# Altium schematic sheet Sensor Board.SchDoc
size A3; ApprovedBy: Betül Demirhan; CheckedBy: UDEMY; DrawnBy: Furkan Demirhan; Revision: AA; SheetNumber: 5; SheetTotal: 5; ProjectDescription: Sensor Board of Wireless Security Detector
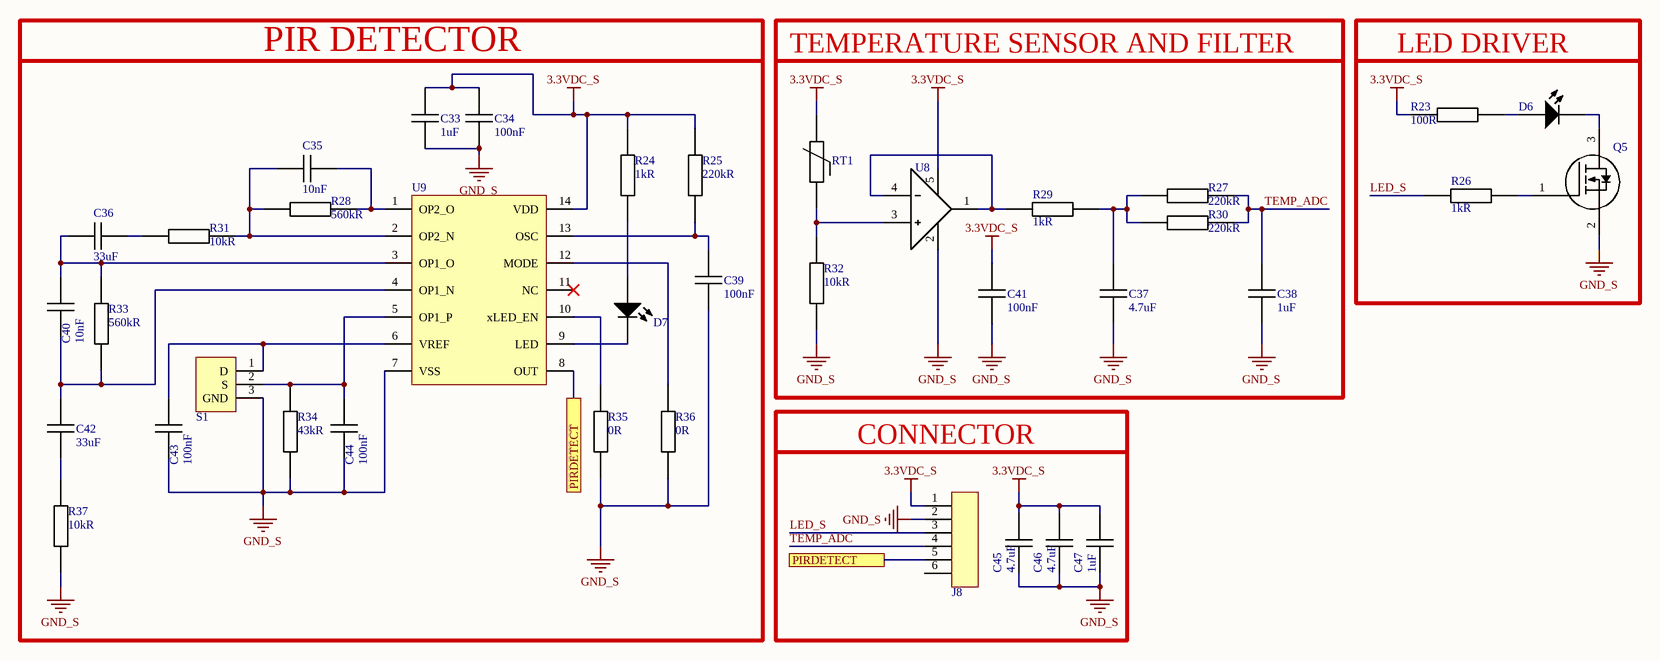
[diagram p0: Sensor Board.SchDoc]

## Parts
C33  value 1uF  [CAP_0805]  (hidden comment: CL21B105KBFNNNE)
C34  value 100nF  [CAP_0805]  (hidden comment: CL21B104KBCNNNC)
C35  value 10nF  [CAP_0603]  (hidden comment: 0603B103K160CT)
C36  value 33uF  [CAP_1206]  (hidden comment: C3216X5R1E336M160AC)
C37  value 4.7uF  [CAP_0805]  (hidden comment: CL21A475KAQNNNE)
C38  value 1uF  [CAP_0805]  (hidden comment: CL21B105KBFNNNE)
C39  value 100nF  [CAP_0603]  (hidden comment: C0603C104M5RACTU)
C40  value 10nF  [CAP_0603]  (hidden comment: 0603B103K160CT)
C41  value 100nF  [CAP_0603]  (hidden comment: C0603C104M5RACTU)
C42  value 33uF  [CAP_1206]  (hidden comment: C3216X5R1E336M160AC)
C43  value 100nF  [CAP_0603]  (hidden comment: C0603C104M5RACTU)
C44  value 100nF  [CAP_0603]  (hidden comment: C0603C104M5RACTU)
C45  value 4.7uF  [CAP_0805]  (hidden comment: CL21A475KAQNNNE)
C46  value 4.7uF  [CAP_0805]  (hidden comment: CL21A475KAQNNNE)
C47  value 1uF  [CAP_0805]  (hidden comment: CL21B105KBFNNNE)
D6  LTST-C171KRKT  [LED_RED_0805]  (value not drawn)
D7  LTST-C171GKT  [LED_GREEN_0805]  (value not drawn)
J8  64800611622  [64800611622]  (value not drawn)
Q5  SSM3K357R,LF  [SOT23F]  (value not drawn)
R23  value 100R  [RES_0603]  (hidden comment: RC0603FR-07100RL)
R24  value 1kR  [RES_0603]  (hidden comment: RC0603FR-071KL)
R25  value 220kR  [RES_0603]  (hidden comment: RC0603JR-07220KL)
R26  value 1kR  [RES_0603]  (hidden comment: RC0603FR-071KL)
R27  value 220kR  [RES_0603]  (hidden comment: RC0603JR-07220KL)
R28  value 560kR  [RES_0603]  (hidden comment: RC0603JR-07560KL)
R29  value 1kR  [RES_0603]  (hidden comment: RC0603FR-071KL)
R30  value 220kR  [RES_0603]  (hidden comment: RC0603JR-07220KL)
R31  value 10kR  [RES_0603]  (hidden comment: RC0603FR-0710KL)
R32  value 10kR  [RES_0603]  (hidden comment: RC0603FR-0710KL)
R33  value 560kR  [RES_0603]  (hidden comment: RC0603JR-07560KL)
R34  value 43kR  [RES_0603]  (hidden comment: RC0603JR-0743KL)
R35  value 0R  [RES_0603]  (hidden comment: RC0603JR-070RL)
R36  value 0R  [RES_0603]  (hidden comment: RC0603JR-070RL)
R37  value 10kR  [RES_0603]  (hidden comment: RC0603FR-0710KL)
RT1  TFPT1206L1002FM  [RT_1206]  (value not drawn)
S1  LHI 878/3902  [LHI 878]  (value not drawn)
U8  OPA314AIDBVR  [SOT23-5]  (value not drawn)
U9  NCS36000DRG  [SOIC14]  (value not drawn)

## Ports
PIRDETECT (see Sensor Board[3B]), PIRDETECT (see Sensor Board[4B])

## Nets
3.3VDC_S: C33.2 C34.1 C41.1 C45.2 C46.2 C47.2 J8.1 R23.1 R24.1 R25.1 RT1.1 U8.5(V+) U9.14(VDD)
GND_S: C33.1 C34.2 C37.1 C38.2 C39.2 C41.2 C43.2 C44.2 C45.1 C46.1 C47.1 J8.2 Q5.2(S) R32.1 R34.2 R35.2 R36.2 R37.1 S1.3(GND) U8.2(V-) U9.7(VSS)
LED_S: J8.3 R26.1
PIRDETECT: J8.5 U9.8(OUT) ; port PIRDETECT
TEMP_ADC: C38.1 J8.4 R27.2 R30.2
NetC35_1: C35.1 R28.2 U9.1(OP2_O)
NetC35_2: C35.2 R28.1 R31.2 U9.2(OP2_N)
NetC36_1: C36.1 R31.1
NetC36_2: C36.2 C40.2 R33.1 U9.3(OP1_O)
NetC37_2: C37.2 R27.1 R29.2 R30.1
NetC39_1: C39.1 R25.2 U9.13(OSC)
NetC40_1: C40.1 C42.1 R33.2 U9.4(OP1_N)
NetC42_2: C42.2 R37.2
NetC43_1: C43.1 S1.1(D) U9.6(VREF)
NetC44_1: C44.1 R34.1 S1.2(S) U9.5(OP1_P)
NetD6_1: D6.1 R23.2
NetD6_2: D6.2 Q5.3(D)
NetD7_1: D7.1 R24.2
NetD7_2: D7.2 U9.9(LED)
NetQ5_1: Q5.1(G) R26.2
NetR29_1: R29.1 U8.1(OUT) U8.4(IN-)
NetR32_2: R32.2 RT1.2 U8.3(IN+)
NetR35_1: R35.1 U9.10(xLED_EN)
NetR36_1: R36.1 U9.12(MODE)

Not connected (* = marked no-connect by the designer): J8 6; U9 11(NC)*

## Notes on the sheet
- PIR DETECTOR
- TEMPERATURE SENSOR AND FILTER
- LED DRIVER
- CONNECTOR
- DOCUMENT NAME
- DESCRIPTION
- DRAWN BY
- RELEASE DATE
- CHECKED BY
- CHANGE DATE
- APPROVED BY
- DEPARTMENT
- R&D Hardware
- SIZE
- A3
- REVISION
- SHEET
- /

## Library data of the parts
C33 C38 C47 = CAP CER 1uF 0805: Multilayer Ceramic Capacitor, 1 uF, 50 V, 10%, X7R, 0805 [2012 Metric]; Manufacturer: Samsung; Voltage Rating: 50V; Designed by: FURKAN; Supplier: Digikey; Supplier Part Number: 1276-1029-1-ND; Manufacturer Part Number: CL21B105KBFNNNE; RoHS: Yes; Category: Ceramic Capacitors; Stock: 845645; Pricing: 1=0,11, 10=0,061, 50=0,042, 100=0,0361, 500=0,02632, 1000=0,02327, 2000=0,02075, 4000=0,01867, 6000=0,01762, 10000=0,01646, 14000=0,01578, 20000=0,01512, 50000=0,0137, 100000=0,01283, 200000=0,01212 (USD); Mounting Technology: Surface Mount; Case/Package: 0805; Case Code (Metric): 2012; Case Code (Imperial): 0805; Material: Ceramic; Min Operating Temperature: -55°C; Max Operating Temperature: 125°C; Tolerance: 10%; Packaging: Tape and Reel; Package Quantity: 1; Dielectric: X7R; Voltage: 50V; Series: CL; Construction: Flat; Voltage Rating (DC): 50V; Length: 2mm; Width: 0.049inch; Height: 1.25mm; Thickness: 0.053inch; Depth: 1.25mm; Radiation Hardening: No; RoHS Compliant: Yes; ComponentLink1URL: https://datasheet.ciiva.com/25800/cl21b105kbfnnne-25800291.pdf?src-supplier=Digikey; ComponentLink1Description: https://datasheet.ciiva.com/25800/cl21b105kbfnnne-25800291.pdf?src-supplier=Digikey; ComponentLink2URL: https://datasheet.ciiva.com/16449/cl21b105kbfnnne-16449003.pdf?src-supplier=Future+Electronics; ComponentLink2Description: https://datasheet.ciiva.com/16449/cl21b105kbfnnne-16449003.pdf?src-supplier=Future+Electronics; ComponentLink3URL: https://datasheet.ciiva.com/26838/getdatasheetpartid-354075-26838668.pdf?src-supplier=Verical; ComponentLink3Description: https://datasheet.ciiva.com/26838/getdatasheetpartid-354075-26838668.pdf?src-supplier=Verical
C34 = CAP CER 100nF 0805: CAP CER 100 nF 10% 50 V 0805 SMD; Manufacturer: Samsung; Designed by: FURKAN; Material: Ceramic; Dielectric: X7R; Voltage Rating: 50V; Supplier: Digikey; Supplier Part Number: 1276-1003-1-ND; Manufacturer Part Number: CL21B104KBCNNNC; RoHS: Yes; Category: Ceramic Capacitors; Stock: 2055733; Pricing: 1=0,1, 10=0,035, 50=0,0238, 100=0,0203, 500=0,01446, 1000=0,01266, 4000=0,00995, 8000=0,00893, 12000=0,00842, 20000=0,00785, 28000=0,00752, 40000=0,0072, 100000=0,00651, 200000=0,00609, 400000=0,00574 (USD); Mounting Technology: Surface Mount; Case/Package: 0805; Case Code (Metric): 2012; Case Code (Imperial): 0805; Min Operating Temperature: -55°C; Max Operating Temperature: 125°C; Tolerance: 10%; Packaging: Tape and Reel; Voltage: 50V; Series: CL; Construction: Flat; Voltage Rating (DC): 50V; Length: 2mm; Width: 0.049inch; Height: 0.85mm; Depth: 1.25mm; Thickness: 0.037inch; Radiation Hardening: No; RoHS Compliant: Yes; Lead Free: 5697LeadFree; ComponentLink1URL: https://datasheet.ciiva.com/25710/cl21b104kbcnnnc-25710182.pdf?src-supplier=Digikey; ComponentLink1Description: https://datasheet.ciiva.com/25710/cl21b104kbcnnnc-25710182.pdf?src-supplier=Digikey; ComponentLink2URL: https://datasheet.ciiva.com/29199/454152-da-01-en-vs-kondensator-0805-29199814.pdf?src-supplier=Conrad; ComponentLink2Description: https://datasheet.ciiva.com/29199/454152-da-01-en-vs-kondensator-0805-29199814.pdf?src-supplier=Conrad
C35 C40 = CAP CER 10nF 0603: CAP CER 10nF 10% 16V 0603 SMD; Manufacturer: Walsin Technologies; Designed by: FURKAN; Supplier: Digikey; Supplier Part Number: 1292-1384-1-ND; Manufacturer Part Number: 0603B103K160CT; RoHS: Yes; Category: Ceramic Capacitors; Stock: 59480; Pricing: 1=0,1, 10=0,031, 50=0,018, 100=0,0139, 500=0,0105, 1000=0,00825 (USD); Lead Free: 5697LeadFree; ComponentLink1URL: http://www.farnell.com/datasheets/1958513.pdf?src-supplier=Farnell; ComponentLink1Description: http://www.farnell.com/datasheets/1958513.pdf?src-supplier=Farnell; ComponentLink2URL: https://datasheet.octopart.com/0603B103K160CT-Walsin-Technologies-datasheet-136037192.pdf?src-supplier=Future+Electronics; ComponentLink2Description: https://datasheet.octopart.com/0603B103K160CT-Walsin-Technologies-datasheet-136037192.pdf?src-supplier=Future+Electronics; ComponentLink3URL: http://www.passivecomponent.com/wp-content/uploads/2018/10/MLCC.pdf?src-supplier=Digikey; ComponentLink3Description: http://www.passivecomponent.com/wp-content/uploads/2018/10/MLCC.pdf?src-supplier=Digikey; ComponentLink4URL: https://datasheet.octopart.com/0603B103K160CT-Walsin-Technologies-datasheet-85392065.pdf?src-supplier=Element14; ComponentLink4Description: https://datasheet.octopart.com/0603B103K160CT-Walsin-Technologies-datasheet-85392065.pdf?src-supplier=Element14; ComponentLink5URL: https://datasheet.octopart.com/0603B103K160CT-Walsin-Technologies-datasheet-62066062.pdf?src-supplier=TME; ComponentLink5Description: https://datasheet.octopart.com/0603B103K160CT-Walsin-Technologies-datasheet-62066062.pdf?src-supplier=TME; Case/Package: 0603
C36 C42 = CAP CER 33uF 1206: CAP CER 33 uF ± 20% 25 V 1206 SMD; Manufacturer: TDK; Designed by: FURKAN; Material: 4241ConductorMaterial; Supplier: Digikey; Supplier Part Number: 445-8046-1-ND; Manufacturer Part Number: C3216X5R1E336M160AC; RoHS: Yes; Category: Ceramic Capacitors; Stock: 176112; Pricing: 1=1,3, 10=0,813, 50=0,6166, 100=0,5552, 500=0,45066, 1000=0,41798 (USD); ComponentLink1URL: https://datasheet.ciiva.com/24216/c3216x5r1e336m160ac-265051-24216512.pdf?src-supplier=Mouser; ComponentLink1Description: https://datasheet.ciiva.com/24216/c3216x5r1e336m160ac-265051-24216512.pdf?src-supplier=Mouser; ComponentLink2URL: https://datasheet.ciiva.com/6285/tdkmlcccaprange-6285278.pdf?src-supplier=Digikey; ComponentLink2Description: https://datasheet.ciiva.com/6285/tdkmlcccaprange-6285278.pdf?src-supplier=Digikey; Case/Package: 1206
C37 C45 C46 = CAP CER 4.7uF 0805: Multilayer Ceramic Capacitor, 4.7 uF, 25 V, ± 10%, X5R, 0805 [2012 Metric]; Manufacturer: Samsung; Designed by: FURKAN; Voltage Rating: 25V; ComponentLink1URL: https://datasheet.ciiva.com/25798/cl21a475kaqnnne-25798882.pdf?src-supplier=Digikey; ComponentLink1Description: https://datasheet.ciiva.com/25798/cl21a475kaqnnne-25798882.pdf?src-supplier=Digikey; Supplier: Digikey; Supplier Part Number: 1276-1244-1-ND; Manufacturer Part Number: CL21A475KAQNNNE; RoHS: Yes; Category: Ceramic Capacitors; Stock: 2972760; Pricing: 1=0,1, 10=0,057, 50=0,0394, 100=0,0339, 500=0,02466, 1000=0,02177 (USD); Mounting Technology: Surface Mount; Case/Package: 0805; Case Code (Metric): 2012; Case Code (Imperial): 0805; Material: Ceramic; Min Operating Temperature: -55°C; Max Operating Temperature: 85°C; Packaging: Tape and Reel; Tolerance: 10%; Dielectric: X5R; Voltage Rating (DC): 25V; Series: CL; Construction: Flat; Length: 2mm; Height: 1.25mm; Depth: 1.25mm; Radiation Hardening: No; Lead Free: Lead Free; RoHS Compliant: Yes
C39 C41 C43 C44 = CAP CER 100nF 0603: CAP CER 100 nF %20 0603 SMD; Manufacturer: KEMET; Designed by: FURKAN; Dielectric Material: 4241ConductorMaterial; Tolerance: 20%; Dielectric: X7R; Voltage Rating: 50V; Dissipation Factor: 2.5%; Temperature Coefficient: 30ppm/°C; Supplier: Digikey; Supplier Part Number: 399-C0603C104M5RACTUCT-ND; Manufacturer Part Number: C0603C104M5RACTU; RoHS: Yes; Category: Ceramic Capacitors; Stock: 2297166; Pricing: 1=0,1, 10=0,027, 50=0,0184, 100=0,0156, 500=0,01104, 1000=0,00962 (USD); Mounting Technology: Surface Mount,PCB; Case/Package: 0603; Pins: 2NUMBER; Case Code (Metric): 1608; Case Code (Imperial): 0603; Material: 4241ConductorMaterial; Min Operating Temperature: -55°C; Max Operating Temperature: 125°C; Package Quantity: 4000; Packaging: Tape and Reel; Voltage Rating (DC): 50V; Termination: SMD/SMT; Series: SMD Comm X7R; Construction: Flat; Length: 1.6mm; Width: 0.031inch; Height: 0.8mm; Thickness: 0.034inch; Lead Pitch: 0.7mm; Depth: 0.8mm; Radiation Hardening: No; Reach SVHC Compliant: No; ComponentLink1URL: http://components.arrow.com/part/dataview/40911037S8853915N7429?src-supplier=Arrow+Electronics; ComponentLink1Description: http://components.arrow.com/part/dataview/40911037S8853915N7429?src-supplier=Arrow+Electronics; ComponentLink2URL: http://www.farnell.com/datasheets/2746056.pdf?src-supplier=Farnell; ComponentLink2Description: http://www.farnell.com/datasheets/2746056.pdf?src-supplier=Farnell; ComponentLink3URL: https://www.verical.com/server-webapp/html/getDatasheet?partID=626892&src-supplier=Verical; ComponentLink3Description: https://www.verical.com/server-webapp/html/getDatasheet?partID=626892&src-supplier=Verical; ComponentLink4URL: http://www.mouser.com/ds/2/212/KEM_C1002_X7R_SMD-1102033.pdf?src-supplier=Mouser; ComponentLink4Description: http://www.mouser.com/ds/2/212/KEM_C1002_X7R_SMD-1102033.pdf?src-supplier=Mouser; ComponentLink5URL: http://www.alliedelec.com/m/d/6f3b5eb83d09db50ed28bdc730567b33.pdf?src-supplier=Allied+Electronics; ComponentLink5Description: http://www.alliedelec.com/m/d/6f3b5eb83d09db50ed28bdc730567b33.pdf?src-supplier=Allied+Electronics; ComponentLink6URL: http://www.farnell.com/datasheets/1828800.pdf?src-supplier=Newark; ComponentLink6Description: http://www.farnell.com/datasheets/1828800.pdf?src-supplier=Newark; ComponentLink7URL: https://datasheet.octopart.com/C0603C104M5RACTU-Kemet-datasheet-5313890.pdf?src-supplier=Verical; ComponentLink7Description: https://datasheet.octopart.com/C0603C104M5RACTU-Kemet-datasheet-5313890.pdf?src-supplier=Verical; ComponentLink8URL: http://capacitoredge.kemet.com/capedge2/DataSheet?pn=C0603C104M5RAC7867&src-supplier=Avnet; ComponentLink8Description: http://capacitoredge.kemet.com/capedge2/DataSheet?pn=C0603C104M5RAC7867&src-supplier=Avnet; ComponentLink9URL: http://www.farnell.com/datasheets/2315113.pdf?src-supplier=Newark; ComponentLink9Description: http://www.farnell.com/datasheets/2315113.pdf?src-supplier=Newark; ComponentLink10URL: https://api.kemet.com/component-edge/download/datasheet/C0603C104M5RACTU.pdf?src-supplier=Digikey; ComponentLink10Description: https://api.kemet.com/component-edge/download/datasheet/C0603C104M5RACTU.pdf?src-supplier=Digikey; ComponentLink11URL: https://datasheet.octopart.com/C0603C104M5RACTU-Kemet-datasheet-65850025.pdf?src-supplier=Element14; ComponentLink11Description: https://datasheet.octopart.com/C0603C104M5RACTU-Kemet-datasheet-65850025.pdf?src-supplier=Element14; ComponentLink12URL: http://www.farnell.com/datasheets/2746056.pdf?src-supplier=Element14; ComponentLink12Description: http://www.farnell.com/datasheets/2746056.pdf?src-supplier=Element14; ComponentLink13URL: http://www.farnell.com/datasheets/2746056.pdf?src-supplier=Newark; ComponentLink13Description: http://www.farnell.com/datasheets/2746056.pdf?src-supplier=Newark; ComponentLink14URL: https://datasheet.octopart.com/C0603C104M5RACTU-KEMET-datasheet-157246124.pdf?src-supplier=Electro+Sonic; ComponentLink14Description: https://datasheet.octopart.com/C0603C104M5RACTU-KEMET-datasheet-157246124.pdf?src-supplier=Electro+Sonic; ComponentLink15URL: https://datasheet.octopart.com/C0603C104M5RACTU-KEMET-datasheet-68331906.pdf?src-supplier=TME; ComponentLink15Description: https://datasheet.octopart.com/C0603C104M5RACTU-KEMET-datasheet-68331906.pdf?src-supplier=TME
D6 = LED RED 0805: LED Uni-Color Red 639nm 2-Pin Chip LED T/R; Manufacturer: Vishay Lite-On; Designed by: FURKAN; Supplier: Digikey; Supplier Part Number: 160-1427-1-ND; Manufacturer Part Number: LTST-C171KRKT; RoHS: Yes; Category: LEDs; Stock: 423441; Pricing: 1=0,23, 10=0,127, 100=0,0762, 500=0,05646, 1000=0,05041 (USD); Wavelength: 639nm; Lead Free: 5697LeadFree; ComponentLink1URL: https://datasheet.ciiva.com/11775/0900766b80dc0299-11775643.pdf?src-supplier=Rs; ComponentLink1Description: https://datasheet.ciiva.com/11775/0900766b80dc0299-11775643.pdf?src-supplier=Rs; ComponentLink2URL: https://datasheet.ciiva.com/12403/lite-on-ltst-c171krkt-187201-12403781.pdf?src-supplier=Mouser; ComponentLink2Description: https://datasheet.ciiva.com/12403/lite-on-ltst-c171krkt-187201-12403781.pdf?src-supplier=Mouser; ComponentLink3URL: https://datasheet.ciiva.com/16444/lite-on20ltst-c171krkt-16444779.pdf?src-supplier=Future+Electronics; ComponentLink3Description: https://datasheet.ciiva.com/16444/lite-on20ltst-c171krkt-16444779.pdf?src-supplier=Future+Electronics; ComponentLink4URL: https://datasheet.ciiva.com/2110/s-110-ltst-c171krkt-2110066.pdf?src-supplier=Digikey; ComponentLink4Description: https://datasheet.ciiva.com/2110/s-110-ltst-c171krkt-2110066.pdf?src-supplier=Digikey; ComponentLink5URL: https://datasheet.ciiva.com/2110/s-110-ltst-c171krkt-2110067.pdf?src-supplier=Digikey; ComponentLink5Description: https://datasheet.ciiva.com/2110/s-110-ltst-c171krkt-2110067.pdf?src-supplier=Digikey; ComponentLink6URL: https://datasheet.ciiva.com/2110/s-110-ltst-c171krkt-2110068.pdf?src-supplier=Digikey; ComponentLink6Description: https://datasheet.ciiva.com/2110/s-110-ltst-c171krkt-2110068.pdf?src-supplier=Digikey; Case/Package: 0805
D7 = LED GREEN 0805: LED Low-Power Uni-Color Green 565nm 2.1V 2-Pin Chip LED T/R; Manufacturer: Vishay Lite-On; Designed by: FURKAN; Lens Color: Colorless; Viewing Angle: 130°; Lens Style: Flat,Diffused,Colorless,Rectangular,Clear; Luminous Intensity: 12mcd; Forward Current: 30mA; Power Rating: 100mW; Dominant Wavelength: 569nm; Test Current: 10mA; Lens Transparency: Clear; Number of Elements: 1; Reverse Voltage: 5V; Lens Size: 1.25mm; Supplier: Digikey; Supplier Part Number: 160-1423-1-ND; Manufacturer Part Number: LTST-C171GKT; RoHS: Yes; Category: LEDs; Stock: 540958; Pricing: 1=0,22, 10=0,121, 100=0,0725, 500=0,0536, 1000=0,04781, 3000=0,04084, 6000=0,03738, 9000=0,03565, 15000=0,03374, 21000=0,03263, 30000=0,03157, 75000=0,02928, 150000=0,0279, 300000=0,02678 (USD); Mounting Technology: Surface Mount; Case/Package: 0805; Pins: 2; Color: Green; Case Code (Metric): 2012; Case Code (Imperial): 0805; Min Operating Temperature: -55°C; Max Operating Temperature: 85°C; Package Quantity: 3000; Packaging: Tape and Reel; Forward Voltage: 2.1V; Illumination Color: Green; Power Dissipation: 100mW; Wavelength: 565nm; Number of LEDs: 1; Series: -; Length: 2mm; Width: 1.25mm; Height: 0.9mm; Depth: 1.25mm; Radiation Hardening: No; Lead Free: Lead Free; RoHS Compliant: Yes; ComponentLink1URL: https://datasheet.ciiva.com/2110/ltst-c171gkt-2110000.pdf?src-supplier=Digikey; ComponentLink1Description: https://datasheet.ciiva.com/2110/ltst-c171gkt-2110000.pdf?src-supplier=Digikey; ComponentLink2URL: https://datasheet.ciiva.com/11773/0900766b80dc0296-11773991.pdf?src-supplier=Rs; ComponentLink2Description: https://datasheet.ciiva.com/11773/0900766b80dc0296-11773991.pdf?src-supplier=Rs; ComponentLink3URL: https://datasheet.ciiva.com/12400/lite-on-ltst-c171gkt-190133-12400647.pdf?src-supplier=Mouser; ComponentLink3Description: https://datasheet.ciiva.com/12400/lite-on-ltst-c171gkt-190133-12400647.pdf?src-supplier=Mouser; ComponentLink4URL: https://datasheet.ciiva.com/2110/ltst-c171gkt-2110001.pdf?src-supplier=Digikey; ComponentLink4Description: https://datasheet.ciiva.com/2110/ltst-c171gkt-2110001.pdf?src-supplier=Digikey; ComponentLink5URL: https://datasheet.ciiva.com/2110/ltst-c171gkt-2110002.pdf?src-supplier=Digikey; ComponentLink5Description: https://datasheet.ciiva.com/2110/ltst-c171gkt-2110002.pdf?src-supplier=Digikey; ComponentLink6URL: https://datasheet.ciiva.com/16396/ltst-c171gkt-16396549.pdf?src-supplier=Future+Electronics; ComponentLink6Description: https://datasheet.ciiva.com/16396/ltst-c171gkt-16396549.pdf?src-supplier=Future+Electronics
J8 = 64800611622_Conn_6Pin: WR-WTB Wire-to-Board Connectors 1.50 mm 6-Pin Connector; Manufacturer: Wurth Electronics; Designed by: FURKAN; Supplier: Digikey; Supplier Part Number: 732-64800611622-ND; Manufacturer Part Number: 64800611622; RoHS: No; Category: Uncategorized; Stock: 1269; Pricing: 1=0,41, 50=0,406, 100=0,384, 250=0,361, 500=0,339 (USD); Case/Package: 64800611622
Q5 = SSM3K357R,LF: Trans MOSFET N-CH Si 60V 0.65A Automotive 3-Pin SOT-23F T/R; Manufacturer: Toshiba; Designed by: FURKAN; Supplier: Digikey; Supplier Part Number: SSM3K357RLFCT-ND; Manufacturer Part Number: SSM3K357R,LF; RoHS: No; Category: LDO; Stock: 27997; Pricing: 1=0,37, 10=0,251, 100=0,1692, 500=0,1312, 1000=0,11858, 3000=0,10224, 6000=0,09388, 9000=0,08959, 15000=0,08474, 21000=0,08186, 30000=0,08125 (USD); ComponentLink1URL: https://toshiba.semicon-storage.com/info/docget.jsp?did=59207&prodName=SSM3K357R&src-supplier=Digikey; ComponentLink1Description: https://toshiba.semicon-storage.com/info/docget.jsp?did=59207&prodName=SSM3K357R&src-supplier=Digikey; Case/Package: SOT23F
R23 = RES 100 OHM 0603: RES 100 OHM 1% 0603 SMD; Manufacturer: Yageo; Designed by: FURKAN; Temperature Coefficient: 100ppm/°C; Voltage Rating (DC): 50V; Power Rating: 100mW; Supplier: Digikey; Supplier Part Number: 311-100HRCT-ND; Manufacturer Part Number: RC0603FR-07100RL; RoHS: Yes; Category: Chip SMD Resistors; Stock: 1340836; Pricing: 1=0,1, 10=0,012, 50=0,0096, 100=0,0071, 500=0,00612, 1000=0,0051 (USD); Case/Package: 0603; Pins: 2; Case Code (Imperial): 0603; Case Code (Metric): 1608; Min Operating Temperature: -55°C; Max Operating Temperature: 155°C; Tolerance: 1%; Resistor Type: Thick Film; Packaging: Tape and Reel; Voltage Rating: 50V; Termination: SMD/SMT; Features: Moisture Resistant; Series: RC; Max Power Dissipation: 100mW; Number of Terminations: 2; Construction: Rectangular; Resistance Tolerance: 1%; Technology: THICK FILM; Length: 1.6mm; Width: 0.8mm; Height: 0.45mm; Depth: 0.8mm; Lead Free: Lead Free; Reach SVHC Compliant: Unknown; RoHS Compliant: Yes; Military Standard: Not
R24 R26 R29 = RES 1K OHM 0603: RES 1K OHM 1% 0603 SMD; Manufacturer: Yageo; Designed by: FURKAN; Temperature Coefficient: 100ppm/°C; Power Rating: 100mW; Voltage Rating: 50V; Supplier: Digikey; Supplier Part Number: 311-1.00KHRCT-ND; Manufacturer Part Number: RC0603FR-071KL; RoHS: Yes; Category: Chip SMD Resistors; Stock: 6043157; Pricing: 1=0,1, 10=0,012, 50=0,0096, 100=0,0071, 500=0,00612, 1000=0,0051, 5000=0,0051, 10000=0,00221, 15000=0,00204, 25000=0,0019 (USD); Case/Package: 0603; Contact Plating: Tin,Matte; Case Code (Imperial): 0603; Case Code (Metric): 1608; Min Operating Temperature: -55°C; Max Operating Temperature: 155°C; Tolerance: 1%; Resistor Type: Thick Film; Packaging: Tape and Reel; Termination: SMD/SMT; Features: Moisture Resistant; Series: RC; Max Power Dissipation: 100mW; Number of Terminations: 2; Technology: THICK FILM; Resistance Tolerance: 1%; Construction: Rectangular; Length: 1.6mm; Height: 0.45mm; Depth: 0.8mm; Reach SVHC Compliant: No; Lead Free: 5697LeadFree; Military Standard: Not; RoHS Compliant: Yes
R25 R27 R30 = RES 220K OHM 0603: RES 220K OHM 5% 0603 SMD; Manufacturer: Yageo; Designed by: FURKAN; Voltage Rating (AC): 50V; Supplier: Digikey; Supplier Part Number: 311-220KGRCT-ND; Manufacturer Part Number: RC0603JR-07220KL; RoHS: Yes; Category: Chip SMD Resistors; Stock: 611809; Pricing: 1=0,1, 10=0,01, 50=0,0082, 100=0,0061, 500=0,0056, 1000=0,0051 (USD); Lead Free: 5697LeadFree; ComponentLink1URL: https://datasheet.ciiva.com/2452/pyu-r-int-thick-7-2452923.pdf?src-supplier=Digikey; ComponentLink1Description: https://datasheet.ciiva.com/2452/pyu-r-int-thick-7-2452923.pdf?src-supplier=Digikey; ComponentLink2URL: https://datasheet.ciiva.com/2452/pyu-r-int-thick-7-2452924.pdf?src-supplier=Digikey; ComponentLink2Description: https://datasheet.ciiva.com/2452/pyu-r-int-thick-7-2452924.pdf?src-supplier=Digikey; ComponentLink3URL: https://datasheet.ciiva.com/2452/pyu-r-int-thick-7-2452925.pdf?src-supplier=Digikey; ComponentLink3Description: https://datasheet.ciiva.com/2452/pyu-r-int-thick-7-2452925.pdf?src-supplier=Digikey; Case/Package: 0603
R28 R33 = RES 560K OHM 0603: RES 560K OHM 5% 0603 SMD; Manufacturer: Yageo; Designed by: FURKAN; Power Rating: 100mW; Voltage Rating: 75V; Voltage Rating (DC): 50V; Temperature Coefficient: 100ppm/°C; Supplier: Digikey; Supplier Part Number: 311-560KGRCT-ND; Manufacturer Part Number: RC0603JR-07560KL; RoHS: Yes; Category: Chip SMD Resistors; Stock: 401823; Pricing: 1=0,1, 10=0,009, 50=0,005, 5000=0,00306, 10000=0,00255, 15000=0,00204, 25000=0,00186, 35000=0,00172, 50000=0,0016 (USD); Case/Package: 0603; Pins: 2; Case Code (Metric): 1608; Case Code (Imperial): 0603; Weight: 7.1E-05oz; Min Operating Temperature: -55°C; Max Operating Temperature: 155°C; Package Quantity: 1; Tolerance: 5%; Packaging: Tape and Reel; Resistor Type: Thick Film; Number of Terminations: 2; Termination: SMD/SMT; Max Power Dissipation: 100mW; Working Voltage: 75V; Features: Moisture Resistant; Series: RC; Resistance Tolerance: 5%; Technology: THICK FILM; Voltage Rating (AC): 50V; Length: 0.063inch; Width: 0.8mm; Height: 0.022inch; RoHS Compliant: Yes; Reach SVHC Compliant: Unknown; Lead Free: 5697LeadFree; ComponentLink1URL: https://datasheet.ciiva.com/2453/pyu-r-int-thick-7-2453056.pdf?src-supplier=Digikey; ComponentLink1Description: https://datasheet.ciiva.com/2453/pyu-r-int-thick-7-2453056.pdf?src-supplier=Digikey; ComponentLink2URL: https://datasheet.ciiva.com/2453/pyu-r-int-thick-7-2453057.pdf?src-supplier=Digikey; ComponentLink2Description: https://datasheet.ciiva.com/2453/pyu-r-int-thick-7-2453057.pdf?src-supplier=Digikey; ComponentLink3URL: https://datasheet.ciiva.com/2453/pyu-r-int-thick-7-2453055.pdf?src-supplier=Digikey; ComponentLink3Description: https://datasheet.ciiva.com/2453/pyu-r-int-thick-7-2453055.pdf?src-supplier=Digikey
R31 R32 R37 = RES 10K OHM 0603: RES 10K OHM %1 0603 SMD; Manufacturer: Yageo; Designed by: FURKAN; Tolerance: 1%; Temperature Coefficient: 100ppm/°C; Voltage Rating (DC): 50V; Voltage Rating: 75V; Power Rating: 100mW; Supplier: Digikey; Supplier Part Number: 311-10.0KHRCT-ND; Manufacturer Part Number: RC0603FR-0710KL; RoHS: Yes; Category: Chip SMD Resistors; Stock: 5554769; Pricing: 1=0,1, 10=0,012, 50=0,0096, 100=0,0071, 500=0,00662, 1000=0,00612 (USD); Case/Package: 0603; Pins: 2; Case Code (Imperial): 0603; Case Code (Metric): 1608; Weight: 7.1E-05oz; Min Operating Temperature: -55°C; Max Operating Temperature: 155°C; Resistor Type: Thick Film; Packaging: Tape and Reel; Termination: SMD/SMT; Features: Moisture Resistant; Series: RC; Max Power Dissipation: 100mW; Number of Terminations: 2; Resistance Tolerance: 1%; Construction: Rectangular; Length: 1.6mm; Width: 0.8mm; Height: 0.45mm; Depth: 0.8mm; Lead Pitch: 0.3mm; Reach SVHC Compliant: No; Lead Free: 5697LeadFree; RoHS Compliant: Yes; Military Standard: Not; ComponentLink1URL: https://datasheet.ciiva.com/7660/38590-7660789.pdf?src-supplier=Element14; ComponentLink1Description: https://datasheet.ciiva.com/7660/38590-7660789.pdf?src-supplier=Element14; ComponentLink2URL: https://datasheet.ciiva.com/7983/443971-7983596.pdf?src-supplier=Element14; ComponentLink2Description: https://datasheet.ciiva.com/7983/443971-7983596.pdf?src-supplier=Element14; ComponentLink3URL: https://datasheet.ciiva.com/22747/443971-22747519.pdf?src-supplier=Element14; ComponentLink3Description: https://datasheet.ciiva.com/22747/443971-22747519.pdf?src-supplier=Element14; ComponentLink4URL: https://datasheet.ciiva.com/46440/1868787-46440891.pdf?src-supplier=Element14; ComponentLink4Description: https://datasheet.ciiva.com/46440/1868787-46440891.pdf?src-supplier=Element14; ComponentLink5URL: https://datasheet.ciiva.com/7746/1738695-7746239.pdf?src-supplier=Element14; ComponentLink5Description: https://datasheet.ciiva.com/7746/1738695-7746239.pdf?src-supplier=Element14; ComponentLink6URL: https://datasheet.ciiva.com/15189/getdatasheetpartid-409289-15189591.pdf?src-supplier=Verical; ComponentLink6Description: https://datasheet.ciiva.com/15189/getdatasheetpartid-409289-15189591.pdf?src-supplier=Verical
R34 = RES 43K OHM 0603: RES 43K OHM 5% 0603 SMD; Manufacturer: Yageo; Designed by: FURKAN; Supplier: Digikey; Supplier Part Number: 311-43KGRCT-ND; Manufacturer Part Number: RC0603JR-0743KL; RoHS: Yes; Category: Chip SMD Resistors; Stock: 228029; Pricing: 1=0,1, 10=0,007, 50=0,0056, 500=0,00408 (USD); ComponentLink1URL: https://datasheet.ciiva.com/2453/pyu-r-int-thick-7-2453052.pdf?src-supplier=Digikey; ComponentLink1Description: https://datasheet.ciiva.com/2453/pyu-r-int-thick-7-2453052.pdf?src-supplier=Digikey; ComponentLink2URL: https://datasheet.ciiva.com/2453/pyu-r-int-thick-7-2453053.pdf?src-supplier=Digikey; ComponentLink2Description: https://datasheet.ciiva.com/2453/pyu-r-int-thick-7-2453053.pdf?src-supplier=Digikey; ComponentLink3URL: https://datasheet.ciiva.com/2453/pyu-r-int-thick-7-2453054.pdf?src-supplier=Digikey; ComponentLink3Description: https://datasheet.ciiva.com/2453/pyu-r-int-thick-7-2453054.pdf?src-supplier=Digikey; Case/Package: 0603
R35 R36 = RES 0 OHM 0603: RES 0 OHM 1% 0603 SMD; Manufacturer: Yageo; Designed by: FURKAN; Power Rating: 100mW; Voltage Rating (DC): 50V; Temperature Coefficient: 200ppm/°C; Resistance Tolerance: 5%; Supplier: Digikey; Supplier Part Number: 311-0.0GRCT-ND; Manufacturer Part Number: RC0603JR-070RL; RoHS: Yes; Category: Chip SMD Resistors; Stock: 5038818; Pricing: 1=0,1, 10=0,009, 25=0,0068, 50=0,004, 100=0,0036, 250=0,00304 (USD); Case/Package: 0603; Pins: 2; Contact Plating: Tin,Matte; Case Code (Imperial): 0603; Case Code (Metric): 1608; Min Operating Temperature: -55°C; Max Operating Temperature: 155°C; Tolerance: 1%; Resistor Type: Thick Film; Packaging: Tape and Reel; Termination: SMD/SMT; Series: RC; Technology: THICK FILM; Package Quantity: 5000; Voltage Rating: 50V; Features: Moisture Resistant; Max Power Dissipation: 100mW; Number of Terminations: 2; Construction: Rectangular; Length: 1.6mm; Width: 0.8mm; Height: 0.45mm; Depth: 0.8mm; RoHS Compliant: Yes; Reach SVHC Compliant: Unknown; Lead Free: 5697LeadFree; Military Standard: Not; ComponentLink1URL: https://datasheet.ciiva.com/11808/pyu-r-int-6-11808700.pdf?src-supplier=Rs; ComponentLink1Description: https://datasheet.ciiva.com/11808/pyu-r-int-6-11808700.pdf?src-supplier=Rs; ComponentLink2URL: https://datasheet.ciiva.com/22747/443971-22747530.pdf?src-supplier=Element14; ComponentLink2Description: https://datasheet.ciiva.com/22747/443971-22747530.pdf?src-supplier=Element14; ComponentLink3URL: https://datasheet.ciiva.com/12555/rc0603-272842-12555254.pdf?src-supplier=Mouser; ComponentLink3Description: https://datasheet.ciiva.com/12555/rc0603-272842-12555254.pdf?src-supplier=Mouser; ComponentLink4URL: https://datasheet.ciiva.com/7746/1738695-7746421.pdf?src-supplier=Element14; ComponentLink4Description: https://datasheet.ciiva.com/7746/1738695-7746421.pdf?src-supplier=Element14; ComponentLink5URL: https://datasheet.ciiva.com/7746/1738695-7746422.pdf?src-supplier=Element14; ComponentLink5Description: https://datasheet.ciiva.com/7746/1738695-7746422.pdf?src-supplier=Element14; ComponentLink6URL: https://datasheet.ciiva.com/8883/pyu-rc0603-51-rohs-l-4-8883045.pdf?src-supplier=Avnet; ComponentLink6Description: https://datasheet.ciiva.com/8883/pyu-rc0603-51-rohs-l-4-8883045.pdf?src-supplier=Avnet; ComponentLink7URL: https://datasheet.ciiva.com/15189/getdatasheetpartid-329462-15189845.pdf?src-supplier=Verical; ComponentLink7Description: https://datasheet.ciiva.com/15189/getdatasheetpartid-329462-15189845.pdf?src-supplier=Verical
RT1 = TFPT1206L1002FM: Thermistor PTC 10K Ohm 1% 2-Pin 1206 Surface Mount Solder Pad T/R Automotive; Manufacturer: Vishay Dale; Designed by: FURKAN; Value: 10kR; Power Rating: 125mW; Voltage: 40V; Supplier: Digikey; Supplier Part Number: 541-3533-1-ND; Manufacturer Part Number: TFPT1206L1002FM; RoHS: Yes; Category: Linear ICs; Stock: 7054; Pricing: 1=1,17, 5=0,986, 10=0,916, 25=0,8316, 50=0,7726, 100=0,7179, 500=0,60546, 1000=0,56268 (USD); Mounting Technology: Surface Mount; Case/Package: 1206; Case Code (Imperial): 1206; Min Operating Temperature: -55°C; Max Operating Temperature: 125°C; Packaging: Tape and Reel; Package Quantity: 5000; Tolerance: 1%; Max Power Dissipation: 125mW; Termination: SMD/SMT; Series: TFPT; Resistance Tolerance: 1%; Length: 3.2mm; Width: 1.6mm; Height: 0.55mm; Lead Free: Lead Free; RoHS Compliant: Yes; ComponentLink1URL: https://datasheet.ciiva.com/2852/tfpt-2852076.pdf?src-supplier=Digikey; ComponentLink1Description: https://datasheet.ciiva.com/2852/tfpt-2852076.pdf?src-supplier=Digikey
S1 = LHI 878/3902: Sensor Pyro Detector Dual Motion; Manufacturer: Excelitas; Designed by: FURKAN; Max Supply Voltage: 12V; Min Supply Voltage: 2v; Supplier: Digikey; Supplier Part Number: 1601-LHI878/3902-ND; Manufacturer Part Number: LHI878/3902; RoHS: No; Category: Linear ICs; Type: Pyro Detector; Case/Package: LHI 878
U8 = OPA314: IC OPAMP GP 3MHZ RRO SOT23-5; Manufacturer: Texas Instruments; Designed by: FURKAN; Supplier: Digikey; Supplier Part Number: 296-36699-6-ND; Manufacturer Part Number: OPA314AIDBVR; RoHS: Yes; Category: Amplifiers - Op Amps, Buffer, Instrumentation; Stock: 14428; Pricing: 1=1,03, 10=0,741, 25=0,6692, 100=0,5899, 250=0,55212, 500=0,52932, 1000=0,51057 (USD); ComponentLink1URL: https://datasheet.ciiva.com/14456/opa2314-14456281.pdf?src-supplier=Avnet; ComponentLink1Description: https://datasheet.ciiva.com/14456/opa2314-14456281.pdf?src-supplier=Avnet; ComponentLink2URL: https://datasheet.ciiva.com/14462/opa2314-14462006.pdf?src-supplier=Avnet; ComponentLink2Description: https://datasheet.ciiva.com/14462/opa2314-14462006.pdf?src-supplier=Avnet; ComponentLink3URL: https://datasheet.ciiva.com/29638/opa314-29638827.pdf?src-supplier=Digikey; ComponentLink3Description: https://datasheet.ciiva.com/29638/opa314-29638827.pdf?src-supplier=Digikey; Case/Package: SOT23-5
U9 = NCS36000: PIR Controller NCS36000 Series Single 5.75V SOIC-14; Manufacturer: ON Semiconductor; Designed by: FURKAN; Operating Supply Current: 50uA; Quiescent Current: 20uA; Min Supply Voltage: 3V; Output Type: Digital; Supplier: Rs; Supplier Part Number: 8051766P; Manufacturer Part Number: NCS36000DRG; RoHS: Yes; Category: Amplifiers - Op Amps, Buffer, Instrumentation; Pricing: 50=0,757, 100=0,659 (GBP); Case/Package: SOIC; Pins: 14; Min Operating Temperature: -40°C; Max Operating Temperature: 85°C; Package Quantity: 3000; Packaging: Tape and Reel; Max Supply Voltage: 5.75V; Series: -; Input Type: DIGITAL; Nominal Supply Current: 20uA; Length: 8.75mm; Width: 4mm; Height: 1.5mm; Radiation Hardening: No; Reach SVHC Compliant: No; Lead Free: Lead Free; Halogen Free: Halogen Free; RoHS Compliant: Yes; ComponentLink1URL: https://datasheet.ciiva.com/4763/ncs36000-d-89569-4763639.pdf?src-supplier=Mouser; ComponentLink1Description: https://datasheet.ciiva.com/4763/ncs36000-d-89569-4763639.pdf?src-supplier=Mouser; ComponentLink2URL: https://datasheet.ciiva.com/2966/ncs36000-d-2966525.pdf?src-supplier=Avnet; ComponentLink2Description: https://datasheet.ciiva.com/2966/ncs36000-d-2966525.pdf?src-supplier=Avnet